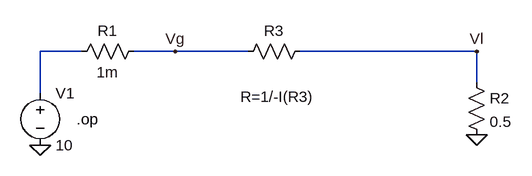
[diagram p0: schematic limiter2.asc]
limiter2.asc, the LTspice schematic file:
Version 4
SHEET 1 880 680
WIRE -144 96 -208 96
WIRE 0 96 -64 96
WIRE 112 96 0 96
WIRE 464 96 192 96
WIRE 464 144 464 96
WIRE -208 160 -208 96
FLAG -208 240 0
FLAG 464 224 0
FLAG 464 96 Vl
FLAG 0 96 Vg
SYMBOL voltage -208 144 R0
WINDOW 123 0 0 Left 0
WINDOW 39 0 0 Left 0
SYMATTR InstName V1
SYMATTR Value 10
SYMBOL res -160 112 R270
WINDOW 0 32 56 VTop 2
WINDOW 3 0 56 VBottom 2
SYMATTR InstName R1
SYMATTR Value 1m
SYMBOL res 448 128 R0
SYMATTR InstName R2
SYMATTR Value 0.5
SYMBOL res 208 80 R90
WINDOW 0 0 56 VBottom 2
WINDOW 3 70 51 VTop 2
SYMATTR InstName R3
SYMATTR Value R=1/-I(R3)
TEXT -152 200 Left 2 !.op

The netlist it stands for:
* limiter2.asc
V1 N001 0 10
R1 N001 Vg 1m
R2 Vl 0 0.5
R3 Vl Vg R=1/-I(R3)
.op
.backanno
.end